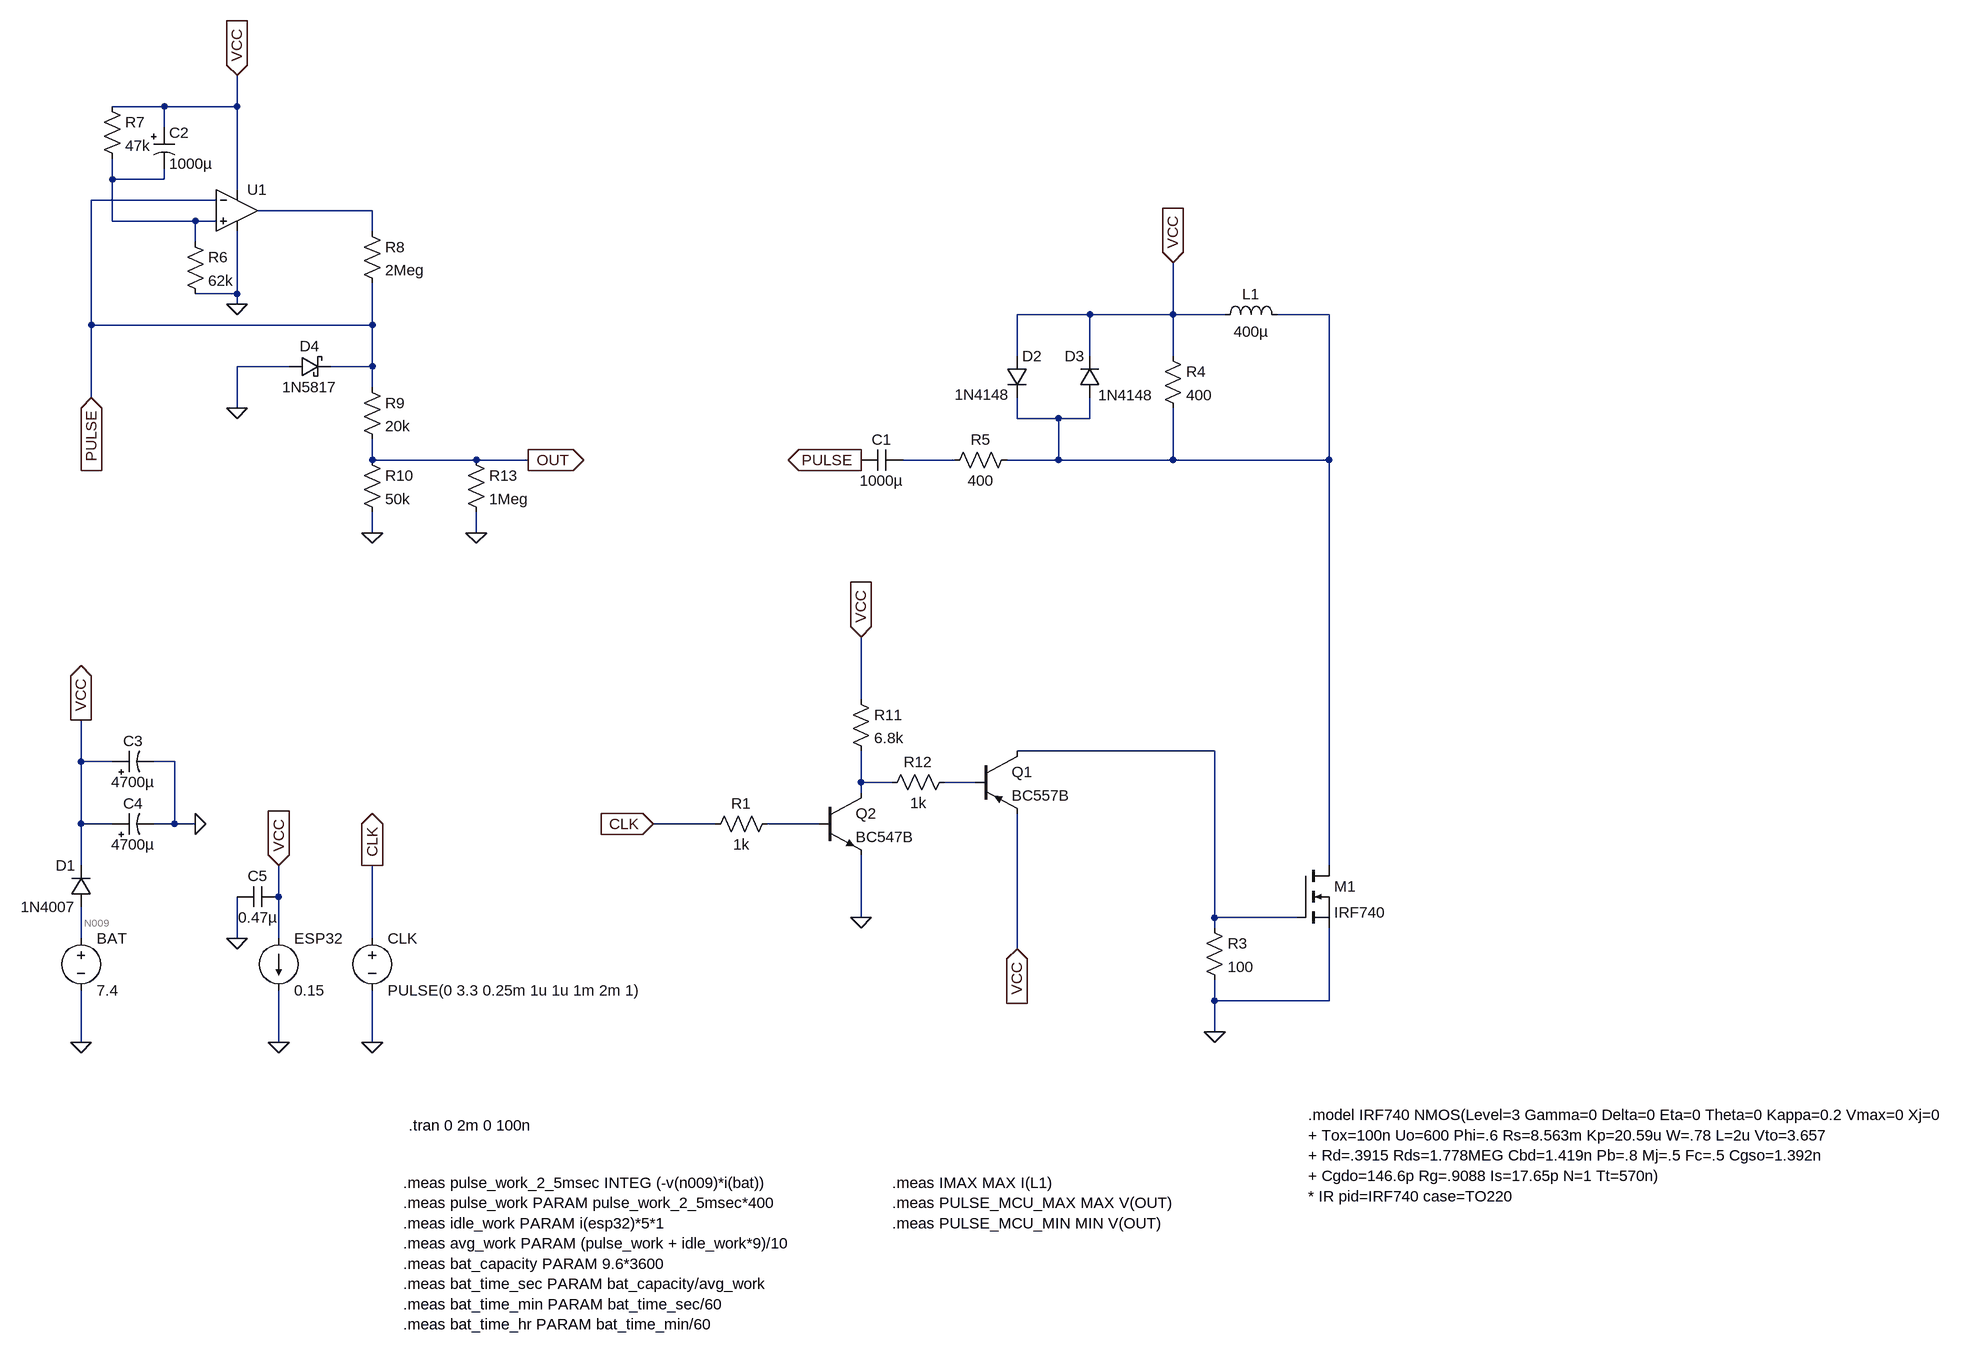
[diagram p0: schematic GitKop.asc]
GitKop.asc, the LTspice schematic file:
Version 4
SHEET 1 1920 840
WIRE -912 -1104 -992 -1104
WIRE -800 -1104 -800 -1152
WIRE -800 -1104 -912 -1104
WIRE -912 -1072 -912 -1104
WIRE -992 -992 -992 -1024
WIRE -912 -992 -912 -1008
WIRE -912 -992 -992 -992
WIRE -800 -976 -800 -1104
WIRE -832 -960 -1024 -960
WIRE -592 -944 -768 -944
WIRE -992 -928 -992 -992
WIRE -864 -928 -992 -928
WIRE -832 -928 -864 -928
WIRE -592 -912 -592 -944
WIRE -864 -896 -864 -928
WIRE -800 -816 -800 -912
WIRE -800 -816 -864 -816
WIRE -800 -800 -800 -816
WIRE 512 -784 400 -784
WIRE 640 -784 640 -864
WIRE 640 -784 512 -784
WIRE 720 -784 640 -784
WIRE 880 -784 800 -784
WIRE -1024 -768 -1024 -960
WIRE -592 -768 -592 -832
WIRE -592 -768 -1024 -768
WIRE 400 -720 400 -784
WIRE 512 -720 512 -784
WIRE 640 -720 640 -784
WIRE -720 -704 -800 -704
WIRE -592 -704 -592 -768
WIRE -592 -704 -656 -704
WIRE -592 -672 -592 -704
WIRE -1024 -656 -1024 -768
WIRE -800 -640 -800 -704
WIRE 400 -624 400 -656
WIRE 464 -624 400 -624
WIRE 512 -624 512 -656
WIRE 512 -624 464 -624
WIRE -592 -560 -592 -592
WIRE -432 -560 -592 -560
WIRE -352 -560 -432 -560
WIRE 304 -560 224 -560
WIRE 464 -560 464 -624
WIRE 464 -560 384 -560
WIRE 640 -560 640 -640
WIRE 640 -560 464 -560
WIRE 880 -560 880 -784
WIRE 880 -560 640 -560
WIRE -592 -448 -592 -480
WIRE -432 -448 -432 -480
WIRE 160 -192 160 -288
WIRE 704 -112 400 -112
WIRE -1040 -96 -1040 -160
WIRE -992 -96 -1040 -96
WIRE -896 -96 -928 -96
WIRE 160 -64 160 -112
WIRE 208 -64 160 -64
WIRE 336 -64 288 -64
WIRE 160 -48 160 -64
WIRE -1040 0 -1040 -96
WIRE -992 0 -1040 0
WIRE -896 0 -896 -96
WIRE -896 0 -928 0
WIRE -864 0 -896 0
WIRE -64 0 -160 0
WIRE 96 0 16 0
WIRE -1040 64 -1040 0
WIRE 880 64 880 -560
WIRE -736 112 -736 64
WIRE 160 144 160 48
WIRE 704 144 704 -112
WIRE 832 144 704 144
WIRE 704 160 704 144
WIRE -1040 176 -1040 128
WIRE -800 176 -800 112
WIRE -736 176 -736 112
WIRE -592 176 -592 64
WIRE 400 192 400 -16
WIRE 704 272 704 240
WIRE 880 272 880 160
WIRE 880 272 704 272
WIRE 704 320 704 272
WIRE -1040 336 -1040 256
WIRE -736 336 -736 256
WIRE -592 336 -592 256
FLAG -592 336 0
FLAG -1040 336 0
FLAG -1040 -160 VCC
IOPIN -1040 -160 Out
FLAG 160 -288 VCC
IOPIN 160 -288 In
FLAG 704 320 0
FLAG 640 -864 VCC
IOPIN 640 -864 In
FLAG -800 -1152 VCC
IOPIN -800 -1152 In
FLAG -800 -800 0
FLAG -592 -448 0
FLAG -352 -560 OUT
IOPIN -352 -560 Out
FLAG 400 192 VCC
IOPIN 400 192 In
FLAG 160 144 0
FLAG -1024 -656 PULSE
IOPIN -1024 -656 In
FLAG 160 -560 PULSE
IOPIN 160 -560 Out
FLAG -864 0 0
FLAG -592 64 CLK
IOPIN -592 64 Out
FLAG -160 0 CLK
IOPIN -160 0 In
FLAG -736 64 VCC
IOPIN -736 64 In
FLAG -736 336 0
FLAG -432 -448 0
FLAG -800 176 0
FLAG -800 -640 0
SYMBOL voltage -592 160 R0
WINDOW 123 0 0 Left 0
WINDOW 39 0 0 Left 0
SYMATTR InstName CLK
SYMATTR Value PULSE(0 3.3 0.25m 1u 1u 1m 2m 1)
SYMBOL res 32 -16 R90
WINDOW 0 0 56 VBottom 2
WINDOW 3 32 56 VTop 2
SYMATTR InstName R1
SYMATTR Value 1k
SYMBOL pnp 336 -112 R0
SYMATTR InstName Q1
SYMATTR Value BC557B
SYMBOL voltage -1040 160 R0
WINDOW 123 0 0 Left 0
WINDOW 39 0 0 Left 0
SYMATTR InstName BAT
SYMATTR Value 7.4
SYMBOL res 688 144 R0
SYMATTR InstName R3
SYMATTR Value 100
SYMBOL nmos 832 64 R0
SYMATTR InstName M1
SYMATTR Value IRF740
SYMBOL ind 704 -768 R270
WINDOW 0 32 56 VTop 2
WINDOW 3 5 56 VBottom 2
SYMATTR InstName L1
SYMATTR Value 400µ
SYMBOL res 624 -736 R0
SYMATTR InstName R4
SYMATTR Value 400
SYMBOL res 400 -576 R90
WINDOW 0 0 56 VBottom 2
WINDOW 3 32 56 VTop 2
SYMATTR InstName R5
SYMATTR Value 400
SYMBOL cap 224 -576 R90
WINDOW 0 0 32 VBottom 2
WINDOW 3 32 32 VTop 2
SYMATTR InstName C1
SYMATTR Value 1000µ
SYMBOL OpAmps\\UniversalOpAmp2 -800 -944 R0
SYMATTR InstName U1
SYMBOL res -880 -912 R0
SYMATTR InstName R6
SYMATTR Value 62k
SYMBOL res -1008 -1120 R0
SYMATTR InstName R7
SYMATTR Value 47k
SYMBOL polcap -928 -1072 R0
SYMATTR InstName C2
SYMATTR Value 1000µ
SYMBOL res -608 -928 R0
SYMATTR InstName R8
SYMATTR Value 2Meg
SYMBOL res -608 -688 R0
SYMATTR InstName R9
SYMATTR Value 20k
SYMBOL res -608 -576 R0
SYMATTR InstName R10
SYMATTR Value 50k
SYMBOL npn 96 -48 R0
SYMATTR InstName Q2
SYMATTR Value BC547B
SYMBOL res 144 -208 R0
SYMATTR InstName R11
SYMATTR Value 6.8k
SYMBOL res 304 -80 R90
WINDOW 0 0 56 VBottom 2
WINDOW 3 32 56 VTop 2
SYMATTR InstName R12
SYMATTR Value 1k
SYMBOL diode 384 -720 R0
WINDOW 3 141 60 Left 2
SYMATTR Value 1N4148
SYMATTR InstName D2
SYMBOL diode 528 -656 R180
WINDOW 0 24 64 Left 2
WINDOW 3 139 5 Left 2
SYMATTR InstName D3
SYMATTR Value 1N4148
SYMBOL diode -1024 128 R180
WINDOW 0 24 64 Left 2
WINDOW 3 24 0 Left 2
SYMATTR InstName D1
SYMATTR Value 1N4007
SYMBOL polcap -992 16 R270
WINDOW 0 32 32 VTop 2
WINDOW 3 0 32 VBottom 2
SYMATTR InstName C4
SYMATTR Value 4700µ
SYMATTR Description Capacitor
SYMATTR Type cap
SYMATTR SpiceLine V=25 Irms=3 Rser=0.017 Lser=0 mfg="Panasonic" pn="ECA1EFQ472" type="Al electrolytic"
SYMBOL current -736 176 R0
WINDOW 123 0 0 Left 0
WINDOW 39 0 0 Left 0
SYMATTR InstName ESP32
SYMATTR Value 0.15
SYMBOL res -448 -576 R0
SYMATTR InstName R13
SYMATTR Value 1Meg
SYMBOL polcap -992 -80 R270
WINDOW 0 32 32 VTop 2
WINDOW 3 0 32 VBottom 2
SYMATTR InstName C3
SYMATTR Value 4700µ
SYMATTR Description Capacitor
SYMATTR Type cap
SYMATTR SpiceLine V=16 Irms=1.56 Rser=0.045 Lser=0 mfg="Nichicon" pn="UPR1C472MRH" type="Al electrolytic"
SYMBOL cap -736 96 R90
WINDOW 0 0 32 VBottom 2
WINDOW 3 32 32 VTop 2
SYMATTR InstName C5
SYMATTR Value 0.47µ
SYMATTR SpiceLine V=10 Irms=3.75 Rser=0.0298746 Lser=0 mfg="KEMET" pn="C1210C474K8RAC" type="X7R"
SYMBOL schottky -720 -688 R270
WINDOW 0 32 32 VTop 2
WINDOW 3 0 32 VBottom 2
SYMATTR InstName D4
SYMATTR Value 1N5817
SYMATTR Description Diode
SYMATTR Type diode
TEXT -536 464 Left 2 !.tran 0 2m 0 100n
TEXT -544 552 Left 2 !.meas pulse_work_2_5msec INTEG (-v(n009)*i(bat))\n.meas pulse_work PARAM pulse_work_2_5msec*400\n.meas idle_work PARAM i(esp32)*5*1\n.meas avg_work PARAM (pulse_work + idle_work*9)/10\n.meas bat_capacity PARAM 9.6*3600\n.meas bat_time_sec PARAM bat_capacity/avg_work\n.meas bat_time_min PARAM bat_time_sec/60\n.meas bat_time_hr PARAM bat_time_min/60
TEXT 208 552 Left 2 !.meas IMAX MAX I(L1)\n.meas PULSE_MCU_MAX MAX V(OUT)\n.meas PULSE_MCU_MIN MIN V(OUT)
TEXT 848 448 Left 2 !.model IRF740 NMOS(Level=3 Gamma=0 Delta=0 Eta=0 Theta=0 Kappa=0.2 Vmax=0 Xj=0\n+ Tox=100n Uo=600 Phi=.6 Rs=8.563m Kp=20.59u W=.78 L=2u Vto=3.657\n+ Rd=.3915 Rds=1.778MEG Cbd=1.419n Pb=.8 Mj=.5 Fc=.5 Cgso=1.392n\n+ Cgdo=146.6p Rg=.9088 Is=17.65p N=1 Tt=570n)\n* IR pid=IRF740 case=TO220

The netlist it stands for:
* GitKop.asc
V§CLK CLK 0 PULSE(0 3.3 0.25m 1u 1u 1m 2m 1)
R1 N008 CLK 1k
Q1 N005 N007 VCC 0 BC557B
V§BAT N009 0 7.4
R3 N005 0 100
M1 N003 N005 0 0 IRF740
L1 VCC N003 400µ
R4 VCC N003 400
R5 N003 N004 400
C1 N004 PULSE 1000µ
XU1 N001 PULSE VCC 0 N002 level2 Avol=1Meg GBW=10Meg Slew=10Meg Ilimit=25m Rail=0 Vos=0 En=0 Enk=0 In=0 Ink=0 Rin=500Meg  ; pins In+ In- V+ V- OUT
R6 N001 0 62k
R7 VCC N001 47k
C2 VCC N001 1000µ
R8 N002 PULSE 2Meg
R9 PULSE OUT 20k
R10 OUT 0 50k
Q2 N006 N008 0 0 BC547B
R11 VCC N006 6.8k
R12 N007 N006 1k
D2 VCC N003 1N4148
D3 N003 VCC 1N4148
D1 N009 VCC 1N4007
C4 VCC 0 4700µ V=25 Irms=3 Rser=0.017 Lser=0 mfg="Panasonic" pn="ECA1EFQ472" type="Al electrolytic"
I§ESP32 VCC 0 0.15
R13 OUT 0 1Meg
C3 VCC 0 4700µ V=16 Irms=1.56 Rser=0.045 Lser=0 mfg="Nichicon" pn="UPR1C472MRH" type="Al electrolytic"
C5 VCC 0 0.47µ V=10 Irms=3.75 Rser=0.0298746 Lser=0 mfg="KEMET" pn="C1210C474K8RAC" type="X7R"
D4 0 PULSE 1N5817
.model D D
.lib standard.dio
.model NPN NPN
.model PNP PNP
.lib standard.bjt
.model NMOS NMOS
.model PMOS PMOS
.lib standard.mos
.tran 0 2m 0 100n
.meas pulse_work_2_5msec INTEG (-v(n009)*i(bat))
.meas pulse_work PARAM pulse_work_2_5msec*400
.meas idle_work PARAM i(esp32)*5*1
.meas avg_work PARAM (pulse_work + idle_work*9)/10
.meas bat_capacity PARAM 9.6*3600
.meas bat_time_sec PARAM bat_capacity/avg_work
.meas bat_time_min PARAM bat_time_sec/60
.meas bat_time_hr PARAM bat_time_min/60
.meas IMAX MAX I(L1)
.meas PULSE_MCU_MAX MAX V(OUT)
.meas PULSE_MCU_MIN MIN V(OUT)
.model IRF740 NMOS(Level=3 Gamma=0 Delta=0 Eta=0 Theta=0 Kappa=0.2 Vmax=0 Xj=0
+ Tox=100n Uo=600 Phi=.6 Rs=8.563m Kp=20.59u W=.78 L=2u Vto=3.657
+ Rd=.3915 Rds=1.778MEG Cbd=1.419n Pb=.8 Mj=.5 Fc=.5 Cgso=1.392n
+ Cgdo=146.6p Rg=.9088 Is=17.65p N=1 Tt=570n)
* IR pid=IRF740 case=TO220
.lib UniversalOpAmp2.lib
.backanno
.end